# Altium schematic sheet PowerSupply.SchDoc
size A4
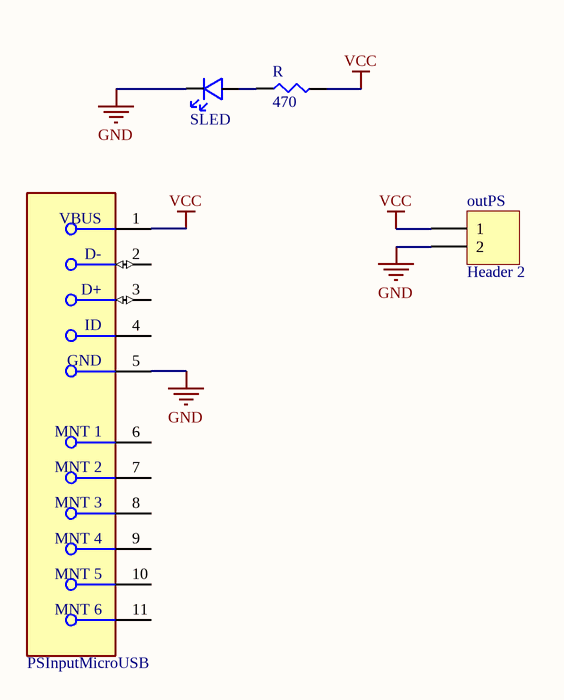
[diagram p0: PowerSupply.SchDoc]

## Parts
outPS  Header 2  [HDR1X2]
PSInputMicroUSB  473460001  [Molex_0_MFG]  (value not drawn)
R  470  [SMD-1206-RES]
SLED  LED  [SMD-1206-RES]  (value not drawn)

## Nets
GND: outPS.2 PSInputMicroUSB.5(GND) SLED.2
VCC: outPS.1 PSInputMicroUSB.1(VBUS) R.2
NetR_1: R.1 SLED.1

Not connected (* = marked no-connect by the designer): PSInputMicroUSB 2(D-) 3(D+) 4(ID) 6(MNT_1) 7(MNT_2) 8(MNT_3) 9(MNT_4) 10(MNT_5) 11(MNT_6)

## Library data of the parts
outPS = Header 2: Header, 2-Pin; LatestRevisionDate: 17-Jul-2002; LatestRevisionNote: Re-released for DXP Platform.; Publisher: Altium Limited
PSInputMicroUSB = 473460001: USB - micro B USB 2.0 Receptacle Connector 5 Position Surface Mount, Right Angle; Manufacturer: Molex; Current Rating: 1.8A; Is Female: yes; Number Of Contacts: 5; Pitch: 0.65mm; Shielding: true; Symbol Hash: 53ae1f1d9b557310b43ca686e5bb76a4a0c306152f4c27f7b0a2433b37067702; Usb Standard: USB 2.0; Verification Version: 0.0.0.3; Voltage Rating: 30V; Datasheet Path: datasheets/Conn_Molex_473460001_eec.pdf; Automotive: No; ComponentLink1Description: Upverter; ComponentLink1URL: https://upverter.com/part/id/076311b223d23811/; ComponentLink2Description: Datasheet; ComponentLink2URL: https://www.molex.com/webdocs/datasheets/pdf/en-us/0473460001_IO_CONNECTORS.pdf; Conn Orientation: Right Angle; Contact Material: Gold,Nickel; Digikey Description: CONN RCPT USB2.0 MICRO B SMD R/A; Digikey Part Number: WM17141CT-ND; Footprint Url: https://www.molex.com/pdm_docs/sd/473460001_sd.pdf; Height: 2.945mm; Lead Free: Yes; Mouser Part Number: 538-47346-0001; Package: 0; Part Number: 473460001; RoHS: TRUE; Supplier 1: Digi-Key; Supplier 2: Mouser; Supplier Part Number 1: WM17141CT-ND; Supplier Part Number 2: 538-47346-0001; Temperature: -30°C to +85°C; Temperature Range High: +85°C; Temperature Range Low: -30°C; helpURL: https://upverter.com/part/id/076311b223d23811/
R = ERJ-8GEYJ471V: RES SMD 470 OHM 5% 1/4W 1206; Manufacturer: Panasonic Electronic Components; Factory Stock: 0; Unit Price (USD): 0.00700; @ qty: 1500; Minimum Quantity: 1; Power (Watts): 0.25W, 1/4W; Temperature Coefficient: ±200ppm/°C; Part Number: ERJ-8GEYJ471V; Datasheets: http://industrial.panasonic.com/www-cgi/jvcr13pz.cgi?E+PZ+3+AOA0001+ERJ8GEYJ471V+7+WW; Image: //media.digikey.com/Renders/Panasonic%20Renders/ERJ-1206%20Pkg.jpg; Digi-Key Part Number: P470ECT-ND; Quantity Available: 509215; Packaging: Cut Tape (CT); Series: ERJ; Part Status: Active; Value: 470; Tolerance: ±5%; Composition: Thick Film; Features: Automotive AEC-Q200; Operating Temperature: -55°C ~ 155°C; Package / Case: 1206 (3216 Metric); Supplier Device Package: 1206; Size / Dimension: 0.126" L x 0.063" W (3.20mm x 1.60mm); Height - Seated (Max): 0.028" (0.70mm); Number of Terminations: 2; Failure Rate: -
SLED = LED: *